# Altium schematic sheet Iout.SchDoc
size 209 x 297 mm; Address1: Address1; Address2: Address2; Address3: Address3; Address4: Address4; DocumentNumber: АБВГ.123456.001 Э3; SheetNumber: 1; Scale: 1:1; DocumentType: Схема электрическая принципиальная; FirstReferrence: АБВГ.123456.001
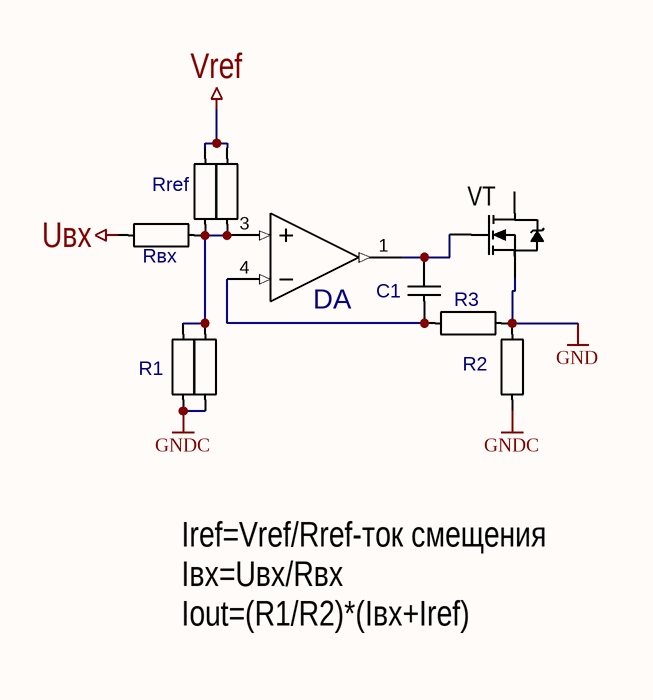
[diagram p0: Iout.SchDoc]

## Parts
(Parts that share a designator on the sheet are numbered #1, #2 ... from top to bottom, then left to right.)
C1  CN0805  [0805]  (value not drawn)
DA  DA-OP-AD8541-SOT23  [SOT23-(5)]  (value not drawn)
R1  R1206  [1206]  (value not drawn)
R2  R1206  [1206]  (value not drawn)
R3  R1206  [1206]  (value not drawn)
R?#1  R1206  [1206]  (value not drawn)
R?#2  R1206  [1206]  (value not drawn)
Rref  R1206  [1206]  (value not drawn)
Rвх  R1206  [1206]  (value not drawn)
VT  (no value)  [SOT23]

## Nets
+3V: DA.5(V+)
GND: DA.2(V-) R2.1 R3.1 VT.2(S)
GNDC: R1.2 R2.2 R?#2.2
Uвх: Rвх.2
Vref: R?#1.1 Rref.1
NetC1_1: C1.1 DA.1(out) VT.1(G)
NetC1_2: C1.2 DA.4(-in) R3.2
NetDA_3: DA.3(+in) R1.1 R?#1.2 R?#2.1 Rref.2 Rвх.1

Not connected (* = marked no-connect by the designer): VT 3(D)

## Notes on the sheet
- Iref=Vref/Rref-ток смещения
  Iвх=Uвх/Rвх
  Iout=(R1/R2)*(Iвх+Iref)
  (см. XTR115)
- Author
- Manufacturer
- Date
- Page
- Total pages
- Size page
- A3
- Materials

## Library data of the parts
C1 = CN0805: Value: 0.1
DA = DA-OP-AD8541-SOT23: Value: MCP6001; OriginalName: AD8531AR; ComponentField7: Published 8-Jun-2000, Modified 10-July-2000: SIM Model Added.; ComponentField6: Pin 8 is not connected. Parameters RG and RB are not available in SPICE. As a result simulation generates an error, however output correct.
R1 = R1206: Value: 10k
R2 = R1206: Value: 20R
R3 = R1206: Value: 100k
R?#2 = R1206: Value: 7k5
Rref = R1206: Value: 750k
Rвх = R1206: Value: 340k
VT = MOSFET_N_132: Manufacturer: Infineon Technologies; ValueManufacturerPartNumber: MOSFET N-channel transistor, 80V, 7A, 9.1nC, 2.5W, 34mOhm, 756pF, 8-TDSON, -55...+150°C; PartNumber: BSC340N08NS3GATMA1; TypeTransistor: MOSFET N-channel transistor; VoltageDS: 80V; CurrentDS: 7A; RDS: 34mOhm; GateCharge: 9.1nC; InputCapacitor: 756pF; MaxPower: 2.5W; Package: 8-TDSON; HelpURL: https://www.digikey.com/product-detail/en/infineon-technologies/BSC340N08NS3GATMA1/BSC340N08NS3GATMA1TR-ND/2080655; Temperature: -55...+150°C